# EAGLE design MAM_GND_V5 (EAGLE 9.5.2)
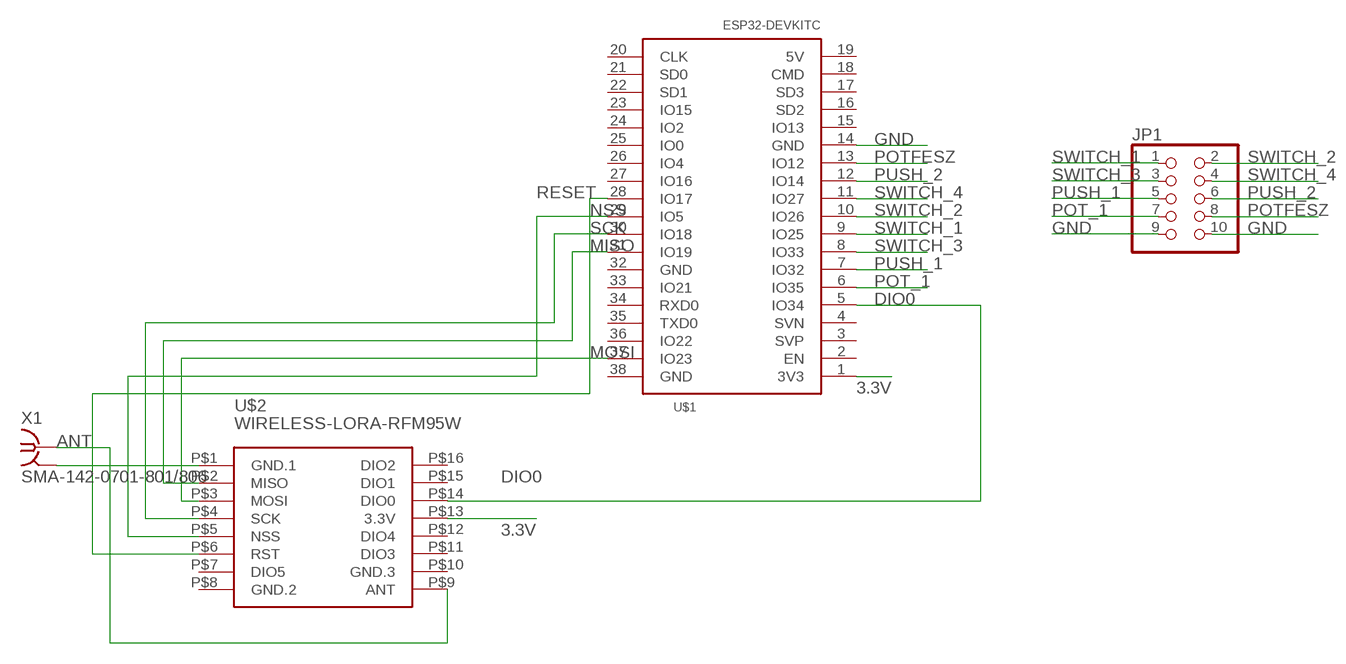
[diagram p0: schematic, sheet 1]

## Parts
JP1  PINHD-2X5  [2X05]
U$1  ESP32DEVKITC  [ESP32-DEVKITC]
U$2  WIRELESS-LORA-RFM95W  [LORA-BREAKOUT]
X1  SMA-142-0701-801/806  [J502-ND-142-0701-801/806]

## Nets
3.3V: U$1.1(3V3) U$2.P$13(3.3V)
ANT: U$2.P$9(ANT) X1.1
DIO0: U$1.5(IO34) U$2.P$14(DIO0)
GND: JP1.9 JP1.10 U$1.14(GND) U$2.P$1(GND.1) X1.G@1 X1.G@2 X1.G@3 X1.G@4
MISO: U$1.31(IO19) U$2.P$2(MISO)
MOSI: U$1.37(IO23) U$2.P$3(MOSI)
NSS: U$1.29(IO5) U$2.P$5(NSS)
POT_1: JP1.7 U$1.6(IO35)
POTFESZ: JP1.8 U$1.13(IO12)
PUSH_1: JP1.5 U$1.7(IO32)
PUSH_2: JP1.6 U$1.12(IO14)
RESET: U$1.28(IO17) U$2.P$6(RST)
SCK: U$1.30(IO18) U$2.P$4(SCK)
SWITCH_1: JP1.1 U$1.9(IO25)
SWITCH_2: JP1.2 U$1.10(IO26)
SWITCH_3: JP1.3 U$1.8(IO33)
SWITCH_4: JP1.4 U$1.11(IO27)
Unconnected: U$1.2(EN) U$1.3(SVP) U$1.4(SVN) U$1.15(IO13) U$1.16(SD2) U$1.17(SD3) U$1.18(CMD) U$1.19(5V) U$1.20(CLK) U$1.21(SD0) U$1.22(SD1) U$1.23(IO15) U$1.24(IO2) U$1.25(IO0) U$1.26(IO4) U$1.27(IO16) U$1.32(GND) U$1.33(IO21) U$1.34(RXD0) U$1.35(TXD0) U$1.36(IO22) U$1.38(GND) U$2.P$7(DIO5) U$2.P$11(DIO3) U$2.P$12(DIO4) U$2.P$15(DIO1) U$2.P$16(DIO2)

## Power pins joined to a net without a drawn wire
GND.2: U$2.P$8(GND.2)
GND.3: U$2.P$10(GND.3)

## Library data of the parts
JP1 = pinhead:PINHD-2X5: PIN HEADER
U$1 = ESP32-DEVKITC:ESP32DEVKITC
U$2 = mam2020:WIRELESS-LORA-RFM95W: 868/915 MHz LoRa Radio Transceiver Module based on SX1276 chip Click here to find device on ebay.com <http://www.ebay.com/sch/RFM95W+transceiver>
X1 = con-coax:SMA-: SMA 50 Ohm End Launch Jack Receptacle - Round Contact Johnson Components Source: www.johnsoncomponents.com .. J502-ND.pdf; MF: JOHNSON COMPONENTS; MPN: 142-0701-801; OC_FARNELL: 1608592; OC_NEWARK: 90F2624

## Board
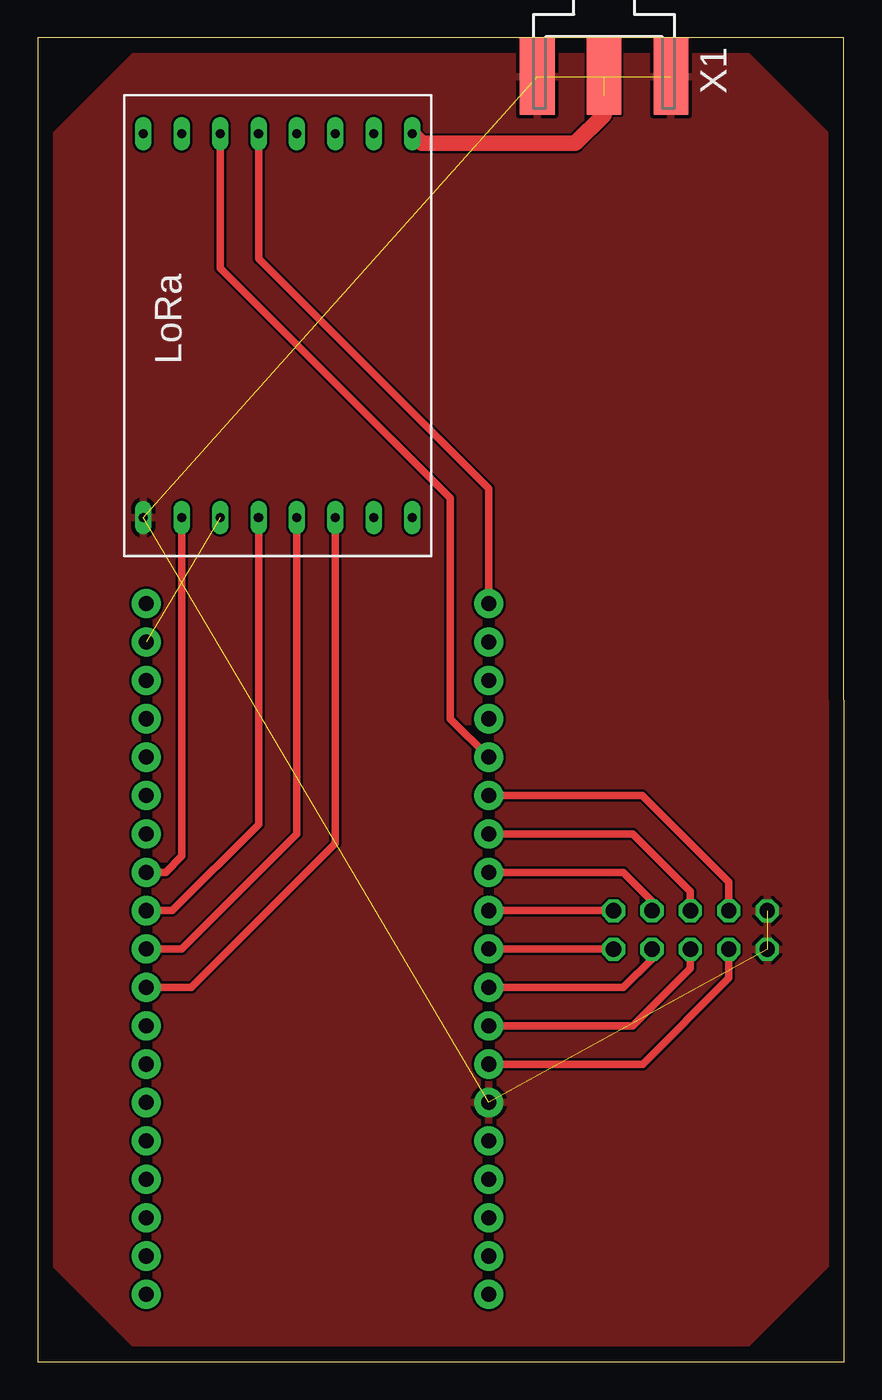
[diagram p1: board, top side]
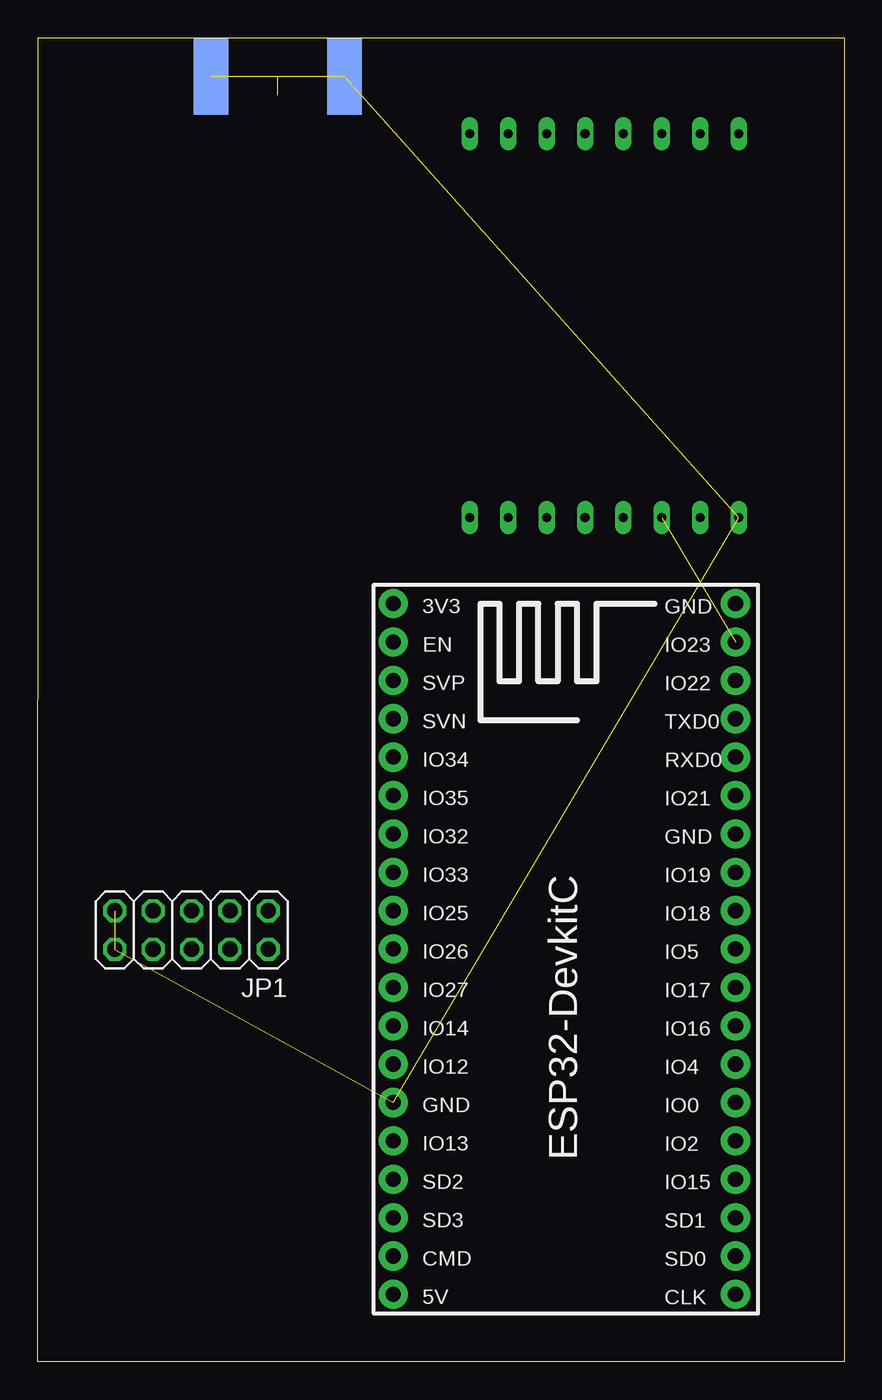
[diagram p2: board, bottom side, seen from below]

Size 53.35 x 87.63 mm. Coordinates in mm from the lower left corner, seen from the top.
Outline: 0,0 53.35,0.01 53.33,87.62 0,87.62 0,0
Copper layers (1*16): Top 0.035mm / dielectric 1.5mm / Bottom 0.035mm
Design rules "default": minimum track width 6mil, minimum drill 0.35mm, track to track 6mil, track to pad 6mil, pad to pad 6mil, via to via 6mil, smd to smd 6mil, copper to edge 40mil, drill to drill 6mil, minimum pad ring 10mil, minimum via ring 8mil, stop-mask expansion 4mil, vias tented up to drill 0mil, thermal gap 10mil

### Footprints (pad centres in the part's own frame; a part is rotated, then mirrored left to right if it is on the bottom)
2X05 = drill 1.016 octagon: 1 -5.08,-1.27; 2 -5.08,1.27; 3 -2.54,-1.27; 4 -2.54,1.27; 5 0,-1.27; 6 0,1.27; 7 2.54,-1.27; 8 2.54,1.27; 9 5.08,-1.27; 10 5.08,1.27
ESP32-DEVKITC = drill 1 pad 1.93: 1 -22.87,-11.42; 2 -20.33,-11.42; 3 -17.79,-11.42; 4 -15.25,-11.42; 5 -12.71,-11.42; 6 -10.17,-11.42; 7 -7.63,-11.42; 8 -5.09,-11.42; 9 -2.55,-11.42; 10 -0.01,-11.42; 11 2.53,-11.42; 12 5.07,-11.42; 13 7.61,-11.42; 14 10.15,-11.42; 15 12.69,-11.42; 16 15.23,-11.42; 17 17.77,-11.42; 18 20.31,-11.42; 19 22.85,-11.42; 20 22.85,11.23; 21 20.31,11.23; 22 17.77,11.23; 23 15.23,11.23; 24 12.69,11.23; 25 10.15,11.23; 26 7.61,11.23; 27 5.07,11.23; 28 2.53,11.23; 29 -0.01,11.23; 30 -2.55,11.23; 31 -5.09,11.23; 32 -7.63,11.23; 33 -10.17,11.23; 34 -12.71,11.23; 35 -15.25,11.23; 36 -17.79,11.23; 37 -20.33,11.23; 38 -22.87,11.23
LORA-BREAKOUT = drill 0.6 long: P$1 -12.7,7.62; P$2 -12.7,5.08; P$3 -12.7,2.54; P$4 -12.7,0; P$5 -12.7,-2.54; P$6 -12.7,-5.08; P$7 -12.7,-7.62; P$8 -12.7,-10.16; P$9 12.7,-10.16; P$10 12.7,-7.62; P$11 12.7,-5.08; P$12 12.7,-2.54; P$13 12.7,0; P$14 12.7,2.54; P$15 12.7,5.08; P$16 12.7,7.62
J502-ND-142-0701-801/806 = smd 5.08 x 2.286: 1 2.565,0; G@1 2.565,4.42; G@2 2.565,-4.42 | smd 5.08 x 2.286 bottom: G@3 2.565,4.42; G@4 2.565,-4.42

### Placement (x,y rotation side)
JP1  43.18,28.57 180 bottom
U$1  18.41,27.3 270 bottom
U$2  14.6,68.58 90 top
X1  37.47,87.63 270 top

### Tracks (layer width: path | path; a pad name or v marks a point on that pad's centre or on a via)
3.3V
  Top 0.508: U$1.1 29.84,57.8 14.6,73.02 U$2.P$13
ANT  (1 unrouted)
  Top 1.016: U$2.P$9 25.4,80.64 35.56,80.64 37.47,82.55 37.47,83.82
DIO0
  Top 0.508: U$1.5 27.3,42.55 27.3,57.15 12.06,72.39 U$2.P$14
GND  (7 unrouted)
  pour Top: 7.62,87.63 45.72,87.63 53.34,80.01 53.34,7.62 45.72,0 7.62,0 0,7.62 0,80.01
MISO
  Top 0.508: U$1.31 8.46,32.4 9.53,33.47 U$2.P$2
MOSI  (1 unrouted)
NSS
  Top 0.508: U$1.29 9.53,27.32 17.15,34.93 U$2.P$5
POT_1
  Top 0.508: U$1.6 40,37.48 45.72,31.75 JP1.7
POTFESZ
  Top 0.508: U$1.13 40.02,19.7 45.72,25.4 JP1.8
PUSH_1
  Top 0.508: U$1.7 39.36,34.94 43.18,31.11 JP1.5
PUSH_2
  Top 0.508: U$1.12 39.38,22.23 43.18,26.04 JP1.6
RESET
  Top 0.508: U$1.28 10.17,24.77 19.69,34.29 U$2.P$6
SCK
  Top 0.508: U$1.30 8.9,29.86 14.6,35.56 U$2.P$4
SWITCH_1
  Top 0.508: U$1.9 38.09,29.86 JP1.1
SWITCH_2
  Top 0.508: U$1.10 JP1.2
SWITCH_3
  Top 0.508: U$1.8 38.73,32.4 40.64,30.48 JP1.3
SWITCH_4
  Top 0.508: U$1.11 38.75,24.77 40.64,26.67 JP1.4